# EAGLE design sd_module (EAGLE 5.07)
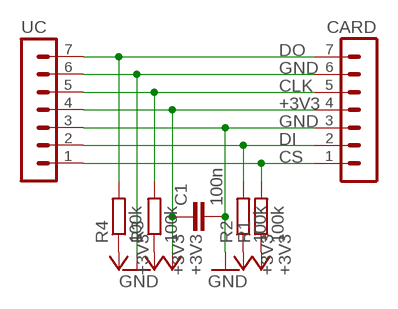
[diagram p0: schematic, sheet 1]

## Parts
C1  100n  C-EUC0805  [C0805]
CARD  MA07-1  [MA07-1]
R1  100k  R-EU_M1206  [M1206]
R2  100k  R-EU_M1206  [M1206]
R3  100k  R-EU_M1206  [M1206]
R4  100k  R-EU_M1206  [M1206]
UC  MA07-1  [MA07-1]

## Nets
+3V3: C1.1 CARD.4 R1.1 R2.1 R3.1 R4.1 UC.4
CLK: CARD.5 R3.2 UC.5
CS: CARD.1 R1.2 UC.1
DI: CARD.2 R2.2 UC.2
DO: CARD.7 R4.2 UC.7
GND: C1.2 CARD.3 CARD.6 UC.3 UC.6

## Library data of the parts
C1 = rcl:C-EU: CAPACITOR, European symbol
CARD UC = con-lstb:MA07-1: PIN HEADER
R1-R4 = rcl:R-EU_: RESISTOR, European symbol

## Board
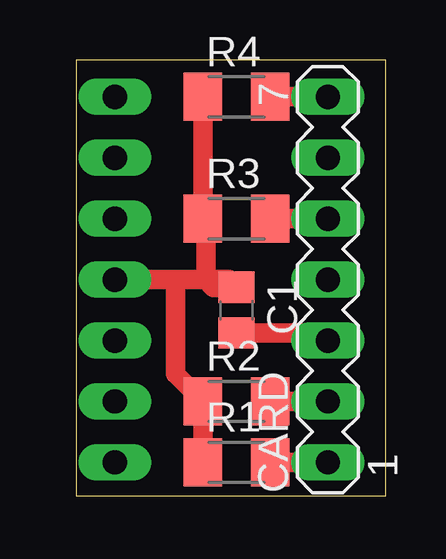
[diagram p1: board, top side]
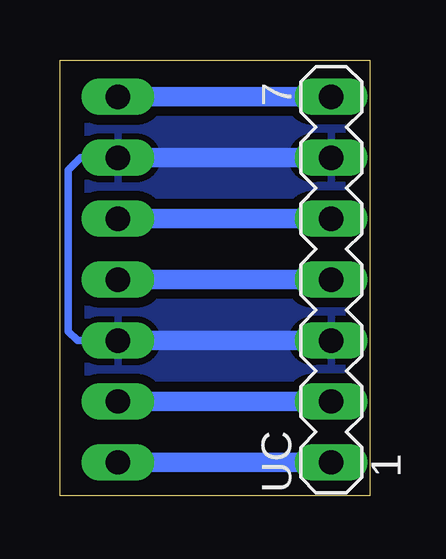
[diagram p2: board, bottom side, seen from below]

Size 12.93 x 18.18 mm. Coordinates in mm from the lower left corner, seen from the top.
Outline: 0.01,0 12.93,0.01 12.92,18.18 0,18.17 0.01,0
Copper layers (1*16): Top 0.035mm / dielectric 1.5mm / Bottom 0.035mm
Design rules "default": minimum track width 10mil, minimum drill 24mil, track to track 8mil, track to pad 8mil, pad to pad 8mil, via to via 8mil, smd to smd 8mil, copper to edge 40mil, drill to drill 8mil, minimum pad ring 10mil, minimum via ring 8mil, stop-mask expansion 4mil, vias tented up to drill 0mil, thermal gap 10mil

### Footprints (pad centres in the part's own frame; a part is rotated, then mirrored left to right if it is on the bottom)
C0805 = smd 1.3 x 1.5: 1 -0.95,0; 2 0.95,0
MA07-1 = drill 1.016 long: 1 -7.62,0; 2 -5.08,0; 3 -2.54,0; 4 0,0; 5 2.54,0; 6 5.08,0; 7 7.62,0
M1206 = smd 1.6 x 2: 1 -1.4,0; 2 1.4,0

### Placement (x,y rotation side)
C1  6.69,7.75 270 top
CARD  10.5,9.02 90 top
R1  6.69,1.4 0 top
R2  6.69,3.94 0 top
R3  6.69,11.56 0 top
R4  6.69,16.64 0 top
UC  1.61,9.02 90 bottom

### Tracks (layer width: path | path; a pad name or v marks a point on that pad's centre or on a via)
+3V3
  Top 0.813: 5.42,9.02 5.42,11.43 R3.1 R4.1 | 4.15,9.02 UC.4 | 5.42,9.02 6.37,9.02 C1.1 5.74,8.7 5.42,9.02 | 4.15,9.02 5.42,9.02 | 4.15,9.02 4.15,5.08 R2.1 R1.1
  Bottom 0.813: UC.4 CARD.4
CLK
  Top 0.813: CARD.5 R3.2
  Bottom 0.813: UC.5 CARD.5
CS
  Top 0.813: CARD.1 R1.2
  Bottom 0.813: UC.1 CARD.1
DI
  Top 0.813: CARD.2 R2.2
  Bottom 0.813: UC.2 CARD.2
DO
  Top 0.813: CARD.7 R4.2
  Bottom 0.813: UC.7 CARD.7
GND
  Top 0.813: C1.2 10.18,6.8 CARD.3
  Bottom 0.305: CARD.6 12.07,14.1 12.58,13.59 12.58,6.86 12.2,6.48 CARD.3 | CARD.3
  Bottom 0.813: CARD.6 UC.6 | UC.3 CARD.3
  pour Bottom (isolate 0.406): 0.07,18.12 -0.2,18.12 -0.2,-0.24 13.06,-0.24 13.06,0.16 12.93,0.16 12.93,18.47